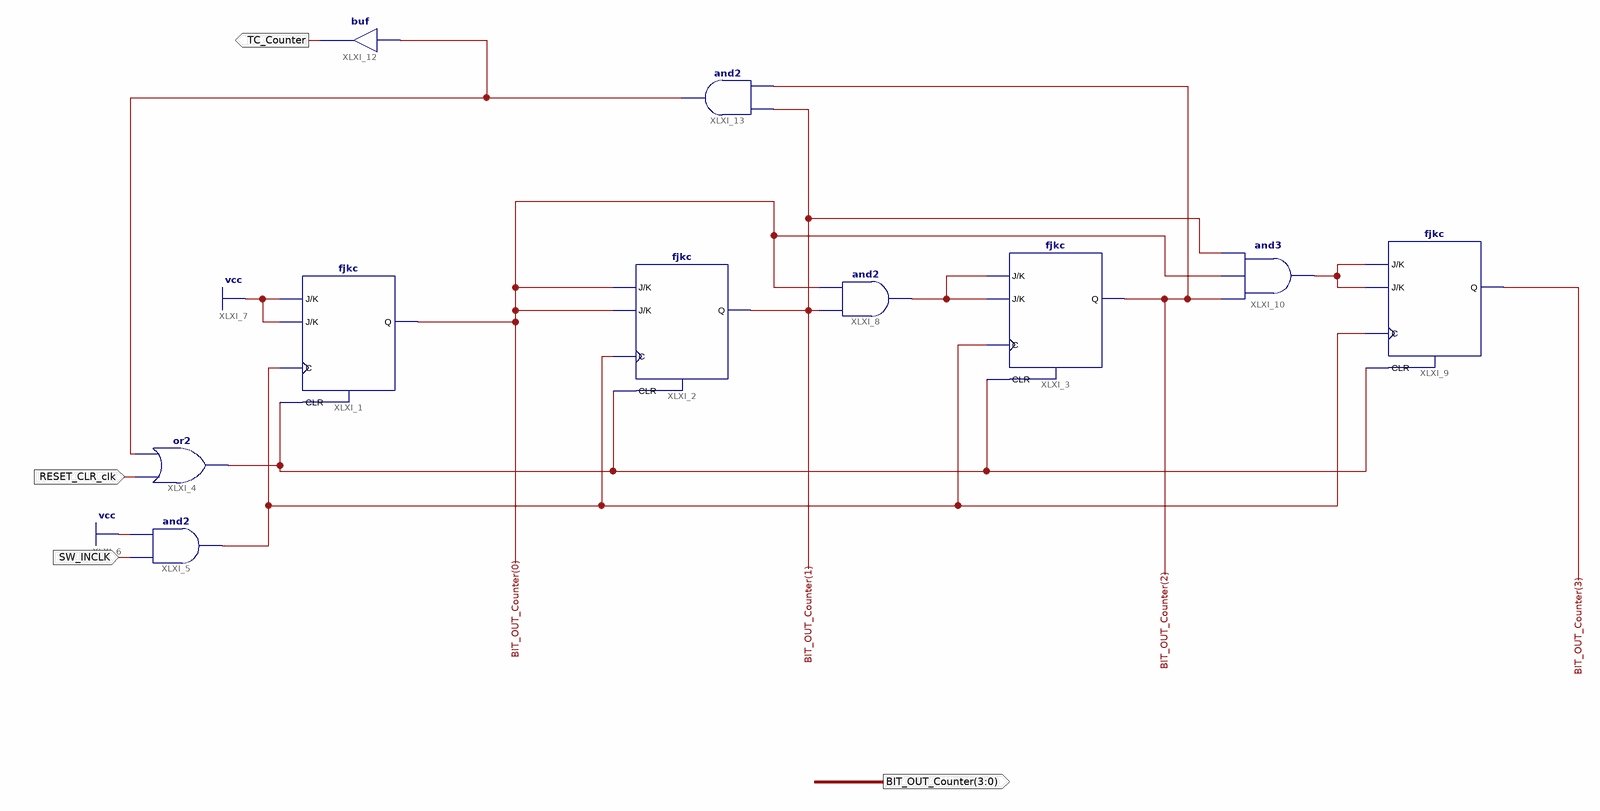
[diagram p0: schematic sheet 1]
// Xilinx ISE schematic Counter0_5_CLR_TC.sch (spartan6) as structural Verilog: 10 symbols, 4 ports
module Counter0_5_CLR_TC (
  input  SW_INCLK,
  input  RESET_CLR_clk,
  output [3:0] BIT_OUT_Counter,
  output TC_Counter
);

  wire XLXN_1, XLXN_6, XLXN_12, XLXN_21, XLXN_29;

  fjkc XLXI_1 (.C(XLXN_6), .CLR(XLXN_1), .J(1'b1), .K(1'b1), .Q(BIT_OUT_Counter[0]));
  fjkc XLXI_2 (.C(XLXN_6), .CLR(XLXN_1), .J(BIT_OUT_Counter[0]), .K(BIT_OUT_Counter[0]), .Q(BIT_OUT_Counter[1]));
  fjkc XLXI_3 (.C(XLXN_6), .CLR(XLXN_1), .J(XLXN_12), .K(XLXN_12), .Q(BIT_OUT_Counter[2]));
  or XLXI_4 (XLXN_1, RESET_CLR_clk, XLXN_29);
  and XLXI_5 (XLXN_6, SW_INCLK, 1'b1);
  and XLXI_8 (XLXN_12, BIT_OUT_Counter[1], BIT_OUT_Counter[0]);
  fjkc XLXI_9 (.C(XLXN_6), .CLR(XLXN_1), .J(XLXN_21), .K(XLXN_21), .Q(BIT_OUT_Counter[3]));
  and XLXI_10 (XLXN_21, BIT_OUT_Counter[2], BIT_OUT_Counter[0], BIT_OUT_Counter[1]);
  buf XLXI_12 (TC_Counter, XLXN_29);
  and XLXI_13 (XLXN_29, BIT_OUT_Counter[2], BIT_OUT_Counter[1]);
endmodule
